# EAGLE design SHT15 (EAGLE 6.2)
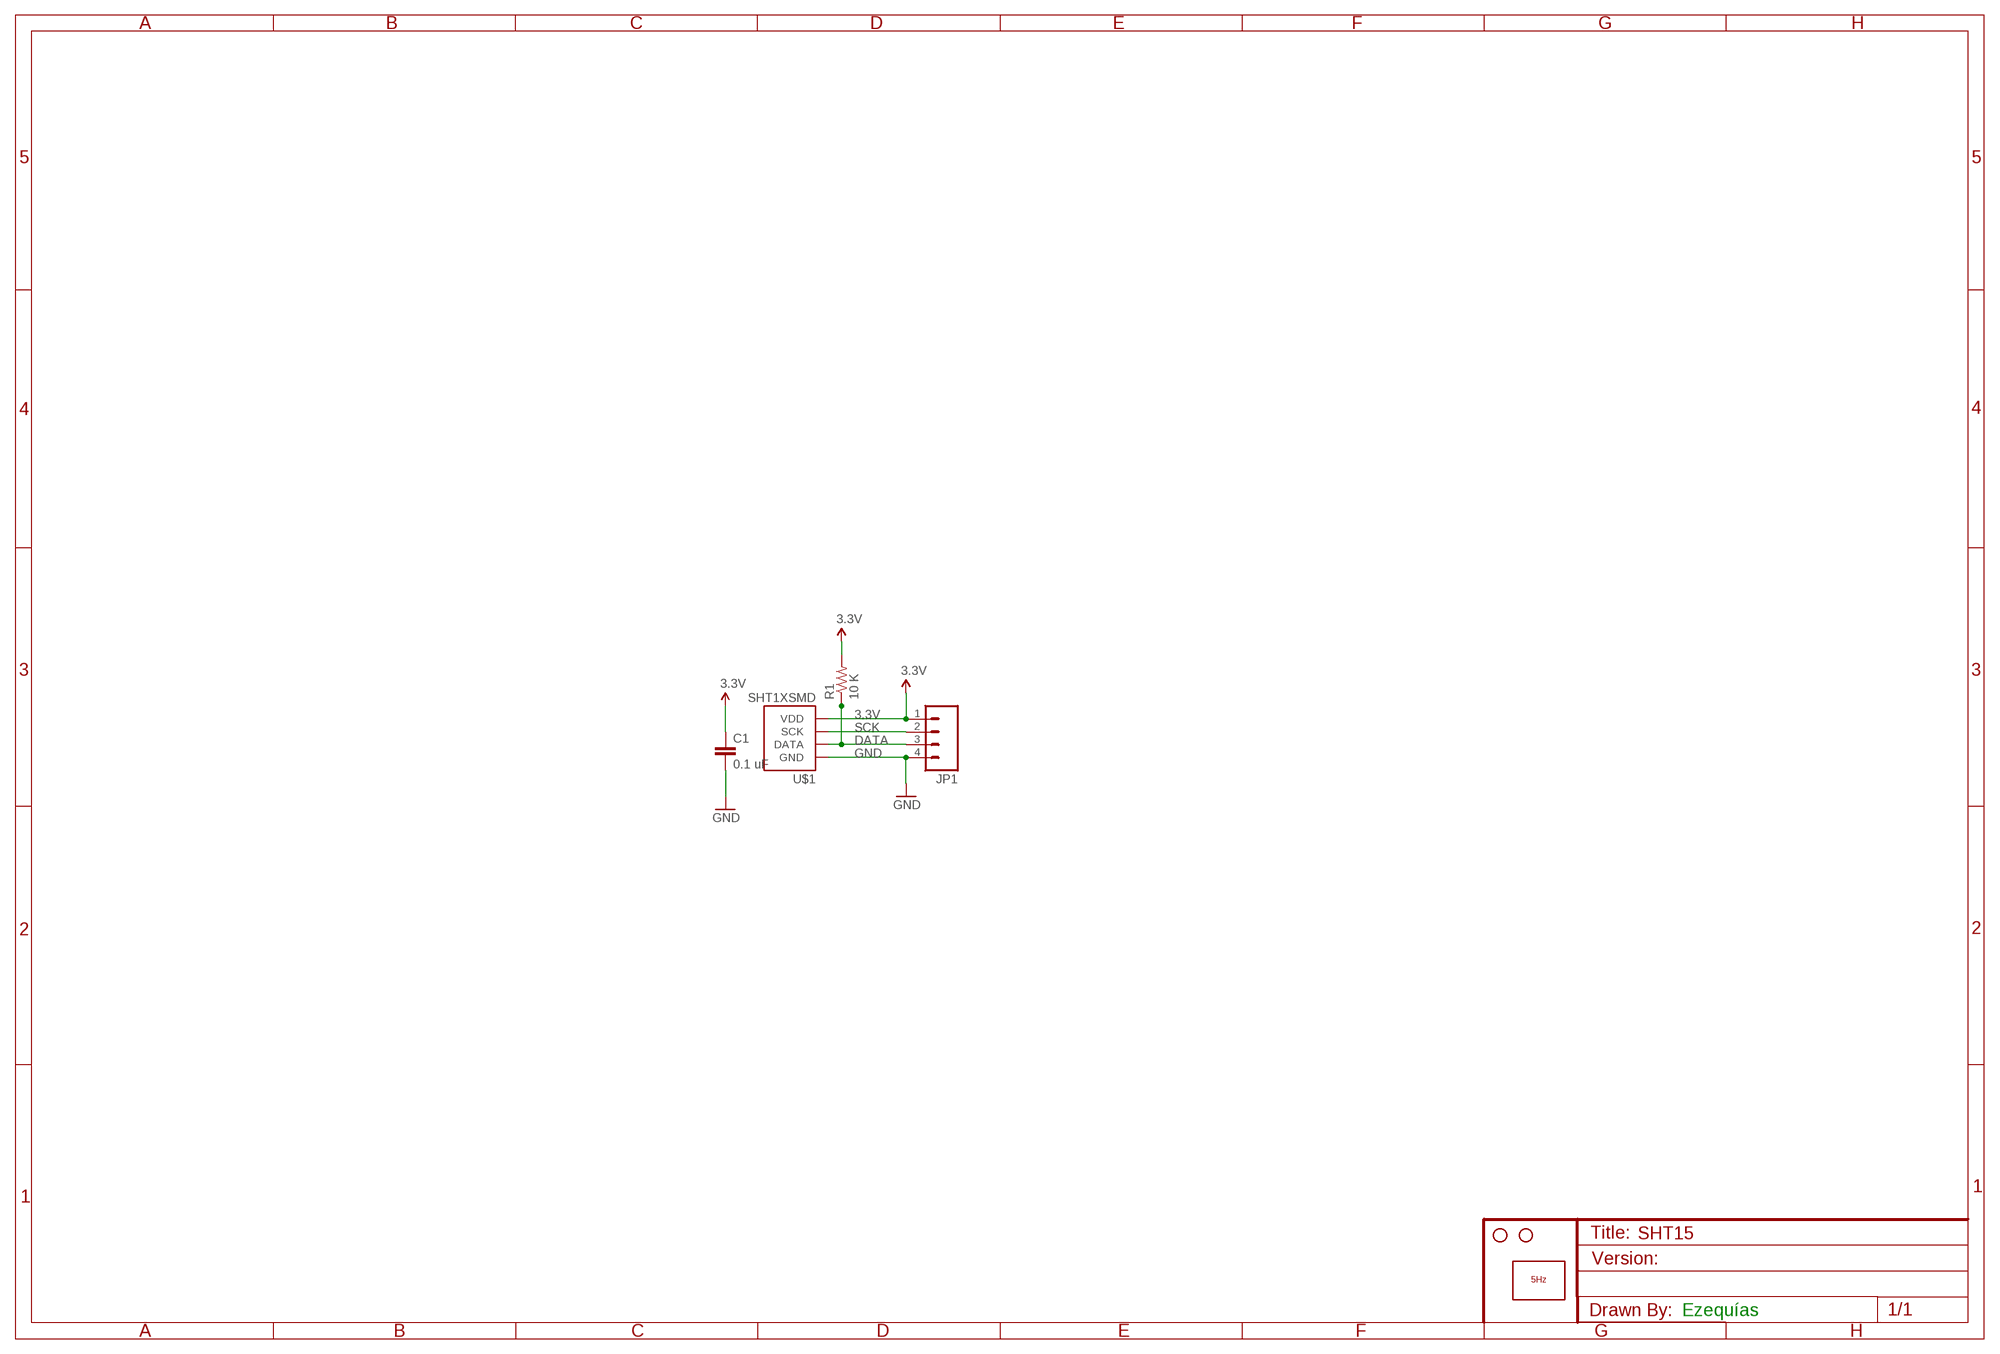
[diagram p0: schematic, sheet 1]

## Parts
C1  0.1 uF  CAP0603-CAP  [0603-CAP]
JP1  M04PTH  [1X04]
JP2  STAND-OFF  [STAND-OFF]
JP3  STAND-OFF  [STAND-OFF]
LOGO1  LOGO_5HZ_H_10MM  [5HZ_LOGO_H_10MM]
R1  10 K  RESISTOR0603-RES  [0603-RES]
U$1  SHT1XSMD  [SHT1X]

## Nets
3.3V: C1.1 JP1.1 R1.2 U$1.4(VDD)
DATA: JP1.3 R1.1 U$1.2(DATA)
GND: C1.2 JP1.4 U$1.1(GND)
SCK: JP1.2 U$1.3(SCK)

## Notes on the sheet
- Ezequías

## Library data of the parts
C1 = SparkFun:CAP: Capacitor Standard 0603 ceramic capacitor, and 0.1" leaded capacitor.
JP1 = SparkFun:M04: Header 4 Standard 4-pin 0.1" header. Use with straight break away headers (SKU : PRT-00116), right angle break away headers (PRT-00553), swiss pins (PRT-00743), machine pins (PRT-00117), and female headers (PRT-00115). Molex polarized connector foot print use with SKU : PRT-08231 with associated crimp pins and housings. 1MM SMD Version SKU: PRT-10208
JP2 JP3 = SparkFun:STAND-OFF: Stand Off This is the mechanical footprint for a #4 phillips button head screw. Use the keepout ring to avoid running the screw head into surrounding components. SKU : PRT-00447
LOGO1 = 5hz-electronica:LOGO_5HZ: Logotipo 5Hz "según Pedro"
R1 = SparkFun:RESISTOR: Resistor Basic schematic elements and footprints for 0603, 1206, and PTH resistors.
U$1 = SparkFun:SHT1X: SHT1x Humdity Sensor Sensirion humdity sensor. Schematic element and footprint proven. Spark Fun Electronics SKU : COM-08227

## Board
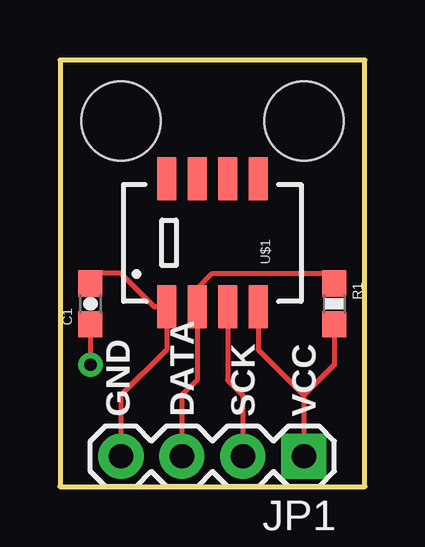
[diagram p1: board, top side]
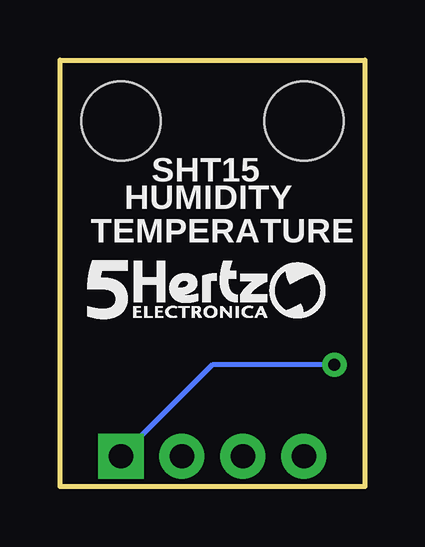
[diagram p2: board, bottom side, seen from below]

Size 12.7 x 17.78 mm. Coordinates in mm from the lower left corner, seen from the top.
Outline: 0,0 12.7,0 12.7,17.78 0,17.78 0,0
Copper layers (1*16): Top 0.035mm / dielectric 1.5mm / Bottom 0.035mm
Design rules: minimum track width 8mil, minimum drill 20mil, track to track 8mil, track to pad 8mil, pad to pad 8mil, via to via 8mil, smd to smd 8mil, copper to edge 10mil, drill to drill 8mil, minimum pad ring 12mil, minimum via ring 10mil, stop-mask expansion 4mil, vias tented up to drill 25mil, thermal gap 10mil

### Footprints (pad centres in the part's own frame; a part is rotated, then mirrored left to right if it is on the bottom)
0603-CAP = smd 1.1 x 1: 1 -0.85,0; 2 0.85,0
1X04 = drill 1.016 pad 1.88 square: 1 0,0 | drill 1.016 pad 1.88: 2 2.54,0; 3 5.08,0; 4 7.62,0
STAND-OFF = hole 3.302: 0,0
0603-RES = smd 1.1 x 1: 1 -0.85,0; 2 0.85,0
SHT1X = smd 1.8 x 0.8: 1 -2.667,1.905; 2 -2.667,0.635; 3 -2.667,-0.635; 4 -2.667,-1.905; 5 2.667,-1.905; 6 2.667,-0.635; 7 2.667,0.635; 8 2.667,1.905

### Placement (x,y rotation side)
C1  1.27,7.62 90 top
JP1  10.16,1.27 180 top
JP2  2.54,15.24 0 top
JP3  10.16,15.24 0 top
LOGO1  11.56,6.99 0 bottom
R1  11.43,7.62 270 top
U$1  6.35,10.16 90 top

### Tracks (layer width: path | path; a pad name or v marks a point on that pad's centre or on a via)
3.3V  (via drill 0.51)
  Top 0.203: U$1.4 8.26,5.71 10.16,3.81 | 10.16,3.81 JP1.1 | R1.2 11.43,5.08 10.16,3.81 | C1.1 v1.27,5.08
  Bottom 0.203: v1.27,5.08 6.35,5.08 JP1.1
DATA
  Top 0.203: JP1.3 5.08,3.81 5.71,4.45 U$1.2 5.71,8.26 6.35,8.89 11.01,8.89 R1.1
GND
  Top 0.203: JP1.4 2.54,3.81 4.45,5.71 U$1.1 3.94,7.49 2.54,8.89 1.69,8.89 C1.2
SCK
  Top 0.203: U$1.3 6.99,4.45 7.62,3.81 JP1.2

### Text on the board
tPlace: GND | DATA | SCK | VCC
bPlace: SHT15 | HUMIDITY | TEMPERATURE